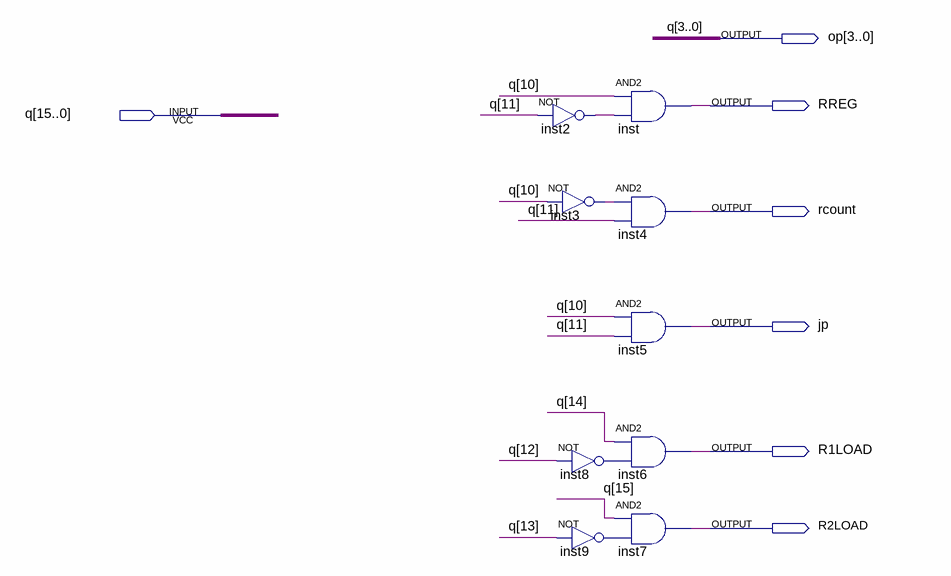
[diagram p0: schematic sheet]
// Quartus schematic controladora.bdf as structural Verilog: 9 symbols, 7 pins
module controladora (
  input  [15:0] q,
  output [3:0] op,
  output RREG,
  output rcount,
  output jp,
  output R1LOAD,
  output R2LOAD
);

  wire inst2_out, inst3_out, inst8_out, inst9_out;

  not inst2 (inst2_out, q[11]);
  not inst3 (inst3_out, q[10]);
  not inst8 (inst8_out, q[12]);
  not inst9 (inst9_out, q[13]);
  and inst (RREG, q[10], inst2_out);
  and inst4 (rcount, inst3_out, q[11]);
  and inst5 (jp, q[10], q[11]);
  and inst6 (R1LOAD, q[14], inst8_out);
  and inst7 (R2LOAD, q[15], inst9_out);

  assign op = q[3:0];
endmodule
